# EAGLE design BSB-Board (EAGLE 8.3.2)
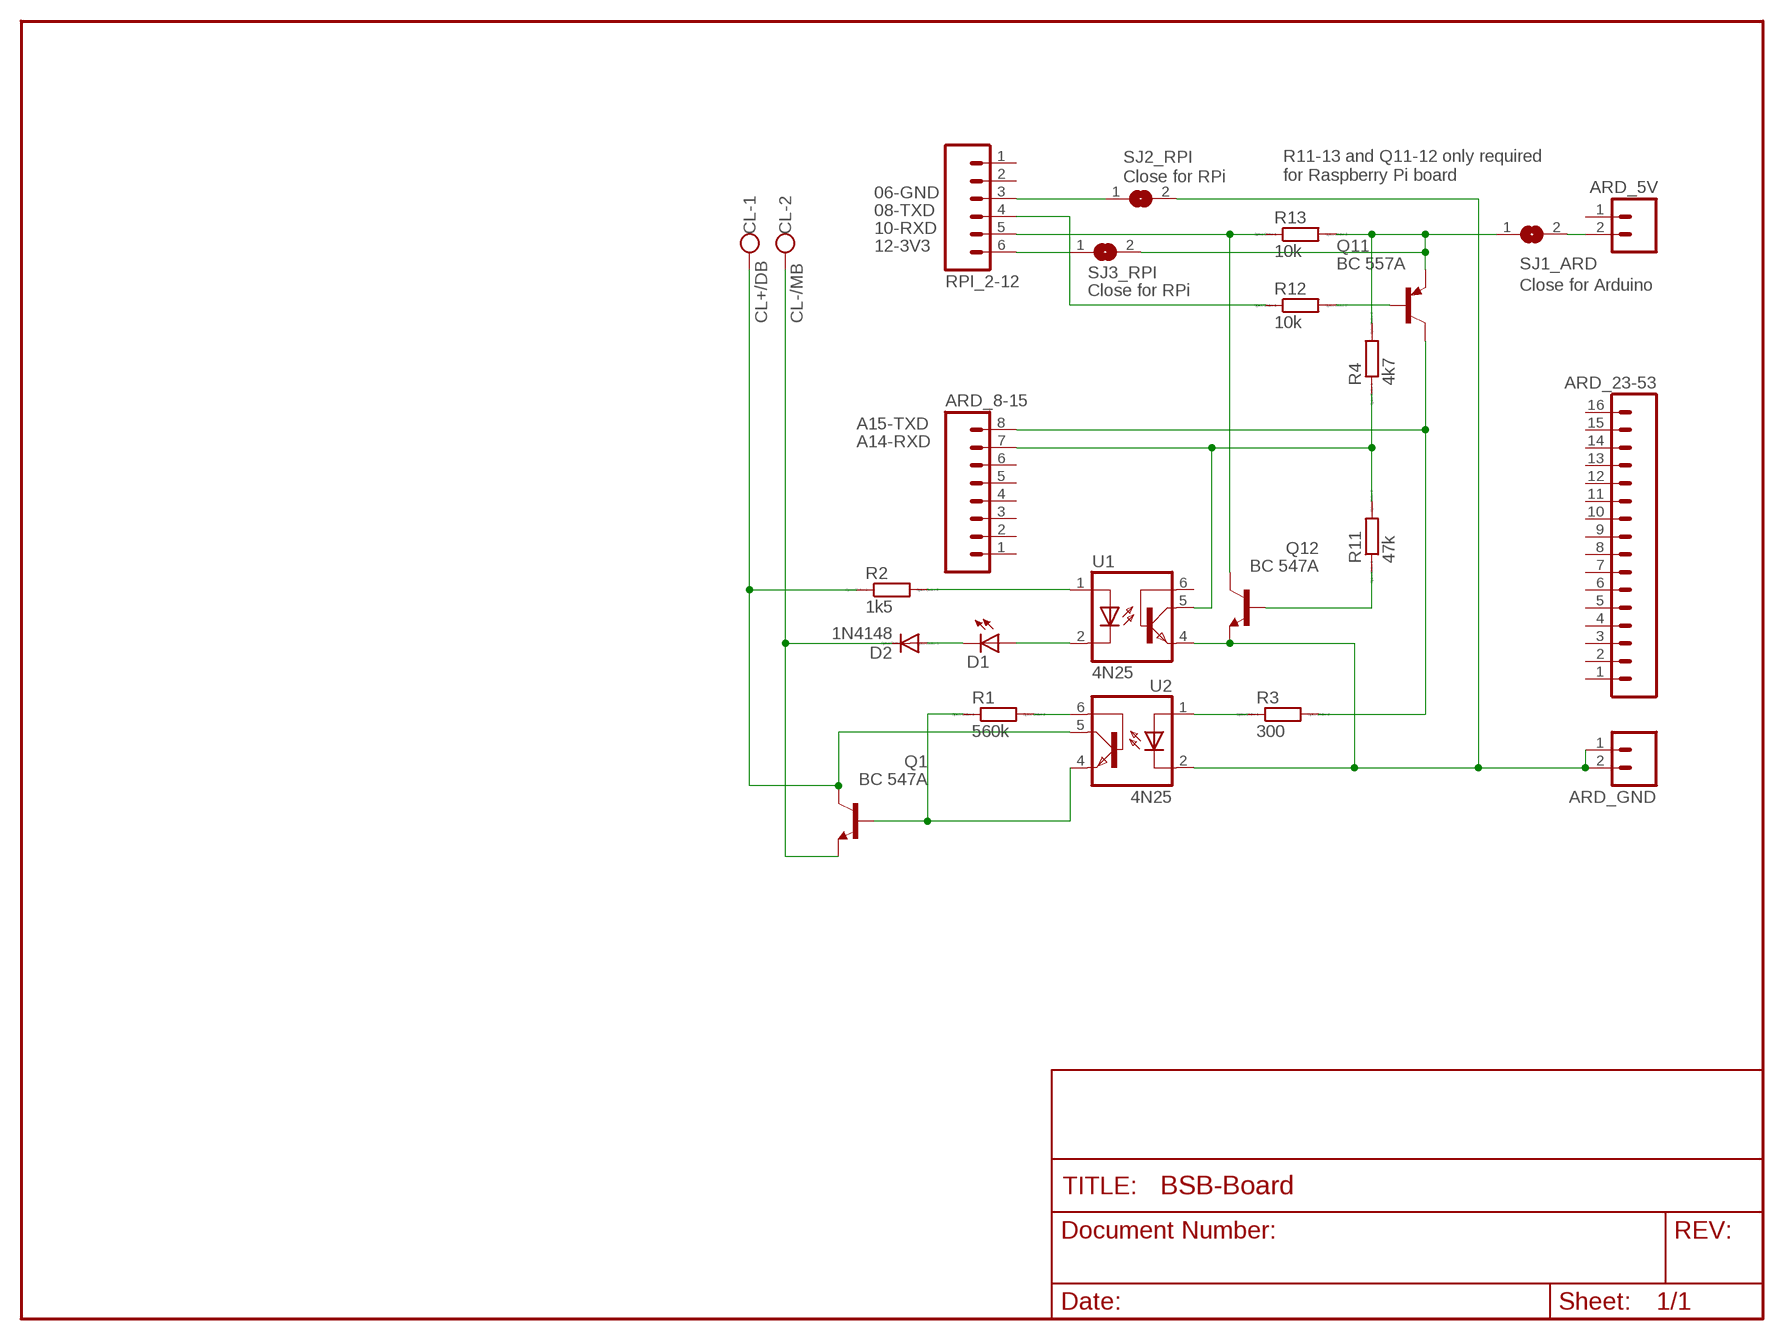
[diagram p0: schematic, sheet 1]

## Parts
ARD_5V  M02PTH  [1X02]
ARD_8-15  M08  [1X08_ROUND]
ARD_23-53  M16PTH  [1X16]
ARD_GND  M02PTH  [1X02]
CL  W237-102  [W237-102]
D1  LEDSQR2X5  [LED2X5]
D2  1N4148  1N4148DO35-7  [DO35-7]
Q1  BC 547A  BC547-NPN-TO92-CBE  [TO92-CBE]
Q11  BC 557A  -PNP-TO92-CBE  [TO92-CBE]
Q12  BC 547A  BC547-NPN-TO92-CBE  [TO92-CBE]
R1  560k  R-EU_0204_7  [0204/7]
R2  1k5  R-EU_0204_7  [0204/7]
R3  300  R-EU_0204_7  [0204/7]
R4  4k7  R-EU_0204_7  [0204/7]
R11  47k  R-EU_0204_7  [0204/7]
R12  10k  R-EU_0204_7  [0204/7]
R13  10k  R-EU_0204_7  [0204/7]
RPI_2-12  M06SILK_FEMALE_PTH  [1X06]
SJ1_ARD  Close for Arduino  SJ  [SJ]
SJ2_RPI  Close for RPi  SJ  [SJ]
SJ3_RPI  Close for RPi  SJ  [SJ]
U1  4N25  4N25M  [DIL06]
U2  4N25  4N25M  [DIL06]

## Nets
5V-ARD: ARD_5V.2 SJ1_ARD.2
A14-RXD-ARD: ARD_8-15.7 R4.1 R11.2 U1.5(COL)
A15-TXD-ARD: ARD_8-15.8 Q11.C R3.2
ARD_PI_TXD: R3.1 U2.1(A)
CL+: CL.1 Q1.C R2.1 U2.5(COL)
CL-: CL.2 D2.C Q1.E
GND-ARD: ARD_GND.1 ARD_GND.2 Q12.E SJ2_RPI.2 U1.4(EMI) U2.2(C)
GPIO14-TXD-PI: R12.1 RPI_2-12.4
GPIO15-RXD-PI: Q12.C R13.1 RPI_2-12.5
GPIO18-3V3-PI: RPI_2-12.6 SJ3_RPI.1
N$1: R2.2 U1.1(A)
N$2: D1.A U1.2(C)
N$3: R1.2 U2.6(BAS)
N$4: D1.K(C) D2.A
N$5: Q1.B R1.1 U2.4(EMI)
N$6: Q12.B R11.1
N$9: Q11.B R12.2
PIN6-GND-PI: RPI_2-12.3 SJ2_RPI.1
VCC: Q11.E R4.2 R13.2 SJ1_ARD.1 SJ3_RPI.2
Unconnected: ARD_5V.1 ARD_8-15.1 ARD_8-15.2 ARD_8-15.3 ARD_8-15.4 ARD_8-15.5 ARD_8-15.6 ARD_23-53.1 ARD_23-53.2 ARD_23-53.3 ARD_23-53.4 ARD_23-53.5 ARD_23-53.6 ARD_23-53.7 ARD_23-53.8 ARD_23-53.9 ARD_23-53.10 ARD_23-53.11 ARD_23-53.12 ARD_23-53.13 ARD_23-53.14 ARD_23-53.15 ARD_23-53.16 RPI_2-12.1 RPI_2-12.2 U1.6(BAS)

## Notes on the sheet
- R11-13 and Q11-12 only required
  for Raspberry Pi board
- 06-GND
- 08-TXD
- 10-RXD
- 12-3V3
- CL+/DB | CL-/MB
- A15-TXD
- A14-RXD

## Library data of the parts
ARD_5V ARD_GND = SparkFun-Connectors:M02: Standard 2-pin 0.1" header. Use with - straight break away headers ( PRT-00116) - right angle break away headers (PRT-00553) - swiss pins (PRT-00743) - machine pins (PRT-00117) - female headers (PRT-00115) Molex polarized connector foot print use with: PRT-08233 with associated crimp pins and housings. 2.54_SCREWTERM for use with PRT-10571. 3.5mm Screw Terminal footprints for PRT-08084 5mm Screw Terminal footprints for use with PRT-08432
ARD_8-15 = SparkFun-Connectors:M08: Header 8 Standard 8-pin 0.1" header. Use with straight break away headers (SKU : PRT-00116), right angle break away headers (PRT-00553), swiss pins (PRT-00743), machine pins (PRT-00117), and female headers (PRT-00115).
ARD_23-53 = SparkFun-Connectors:M16: 1x16 .1" header
CL = con-wago-500:W237-102: WAGO SCREW CLAMP; MPN: 237-102; OC_FARNELL: unknown; OC_NEWARK: 70K9898
D1 = led:LED: LED OSRAM: - CHIPLED LG R971, LG N971, LY N971, LG Q971, LY Q971, LO R971, LY R971 LH N974, LH R974 LS Q976, LO Q976, LY Q976 LO Q996 - Hyper CHIPLED LW Q18S LB Q993, LB Q99A, LB R99A - SideLED LS A670, LO A670, LY A670, LG A670, LP A670 LB A673, LV A673, LT A673, LW A673 LH A674 LY A675 LS A676, LA A676, LO A676, LY A676, LW A676 LS A679, LY A679, LG A679 - Hyper Micro SIDELED® LS Y876, LA Y876, LO Y876, LY Y876 LT Y87S - SmartLED LW L88C, LW L88S LB L89C, LB L89S, LG L890 LS L89K, LO L89K, LY L89K LS L896, LA L896, LO L896, LY L896 - TOPLED LS T670, LO T670, LY T670, LG T670, LP T670 LSG T670, LSP T670, LSY T670, LOP T670, LYG T670 LG T671, LOG T671, LSG T671 LB T673, LV T673, LT T673, LW T673 LH T674 LS T676, LA T676, LO T676, LY T676, LB T676, LH T676, LSB T676, LW T676 LB T67C, LV T67C, LT T67C, LS T67K, LO T67K, LY T67K, LW E67C LS E67B, LA E67B, LO E67B, LY E67B, LB E67C, LV E67C, LT E67C LW T67C LS T679, LY T679, LG T679 LS T770, LO T770, LY T770, LG T770, LP T770 LB T773, LV T773, LT T773, LW T773 LH T774 LS E675, LA E675, LY E675, LS T675 LS T776, LA T776, LO T776, LY T776, LB T776 LHGB T686 LT T68C, LB T68C - Hyper Mini TOPLED® LB M676 - Mini TOPLED Santana® LG M470 LS M47K, LO M47K, LY M47K Source: http://www.osram.convergy.de LUXEON: - LUMILED® LXK2-PW12-R00, LXK2-PW12-S00, LXK2-PW14-U00, LXK2-PW14-V00 LXK2-PM12-R00, LXK2-PM12-S00, LXK2-PM14-U00 LXK2-PE12-Q00, LXK2-PE12-R00, LXK2-PE12-S00, LXK2-PE14-T00, LXK2-PE14-U00 LXK2-PB12-K00, LXK2-PB12-L00, LXK2-PB12-M00, LXK2-PB14-N00, LXK2-PB14-P00, LXK2-PB14-Q00 LXK2-PR12-L00, LXK2-PR12-M00, LXK2-PR14-Q00, LXK2-PR14-R00 LXK2-PD12-Q00, LXK2-PD12-R00, LXK2-PD12-S00 LXK2-PH12-R00, LXK2-PH12-S00 LXK2-PL12-P00, LXK2-PL12-Q00, LXK2-PL12-R00 Source: www.luxeon.com KINGBRIGHT: KA-3528ASYC Source: www.kingbright.com
D2 = diode:1N4148: DIODE high speed (Philips)
Q1 Q12 = transistor:*-NPN-: NPN Transistror BF959 corrected 2008.03.06
Q11 = transistor-neu-to92:*-PNP-: PNP Transistror
R1-R4 R11-R13 = resistor:R-EU_: RESISTOR, European symbol; SPICEPREFIX: R
RPI_2-12 = SparkFun-Connectors:M06: Header 6 Standard 6-pin 0.1" header. Use with straight break away headers (SKU : PRT-00116), right angle break away headers (PRT-00553), swiss pins (PRT-00743), machine pins (PRT-00117), and female headers (PRT-00115). Molex polarized connector foot print use with SKU : PRT-08094 with associated crimp pins and housings. NOTES ON THE VARIANTS LOCK and LOCK_LONGPADS... This footprint was designed to help hold the alignment of a through-hole component (i.e. 6-pin header) while soldering it into place. You may notice that each hole has been shifted either up or down by 0.005 of an inch from it's more standard position (which is a perfectly straight line). This slight alteration caused the pins (the squares in the middle) to touch the edges of the holes. Because they are alternating, it causes a "brace" to hold the component in place. 0.005 has proven to be the perfect amount of "off-center" position when using our standard breakaway headers. Although looks a little odd when you look at the bare footprint, once you have a header in there, the alteration is very hard to notice. Also,if you push a header all the way into place, it is covered up entirely on the bottom side. This idea of altering the position of holes to aid alignment will be further integrated into the Sparkfun Library for other footprints. It can help hold any component with 3 or more connection pins.; PROD_ID: CONN-08437
SJ1_ARD SJ2_RPI SJ3_RPI = jumper:SJ: SMD solder JUMPER
U1 U2 = optocoupler:4N*?M: General Purpose 6-Pin Phototransistor Optocouplers Source: http://www.fairchildsemi.com/ds/4N/4N35-M.pdf; MPN: 4N25-M; OC_FARNELL: 1021349; OC_NEWARK: 98K9084

## Board
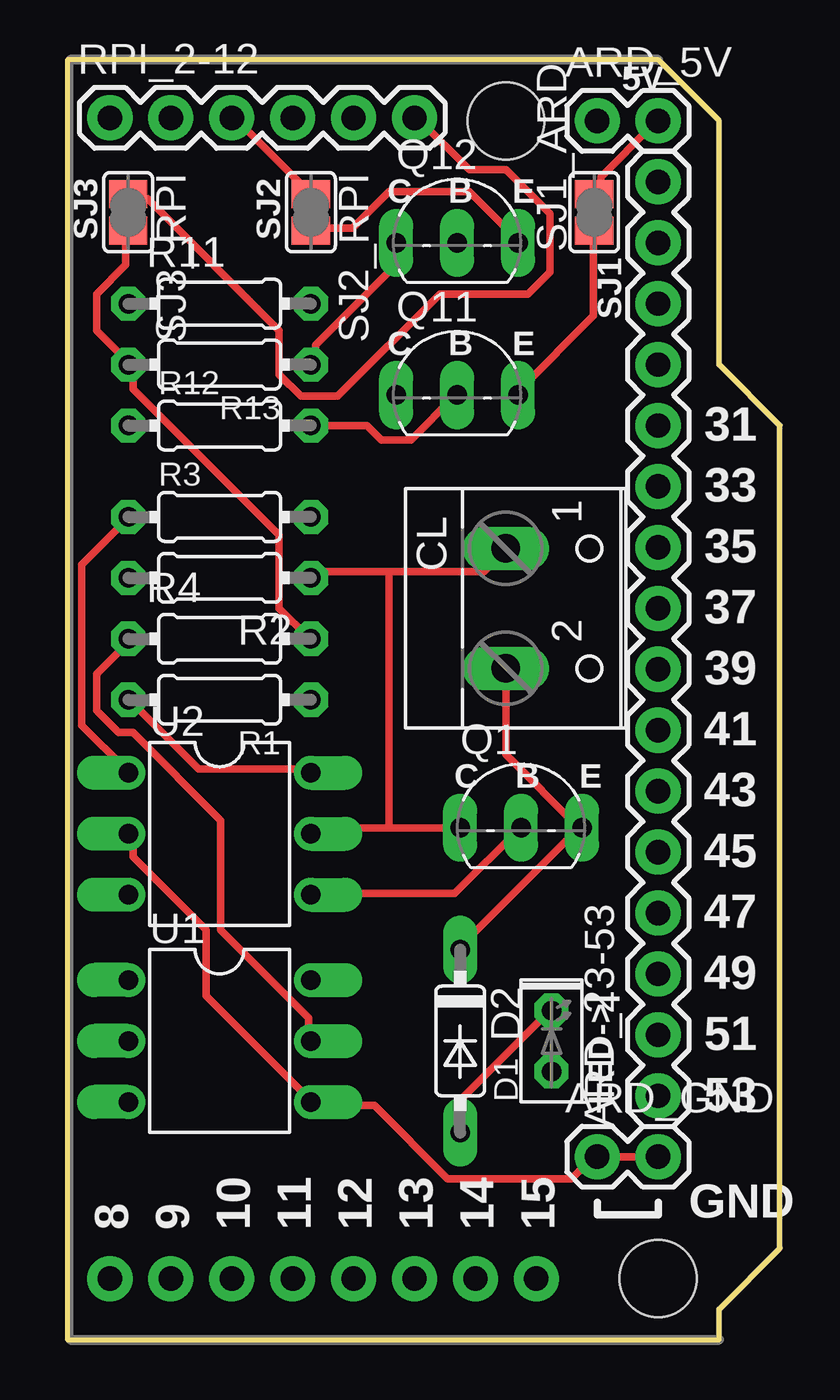
[diagram p1: board, top side]
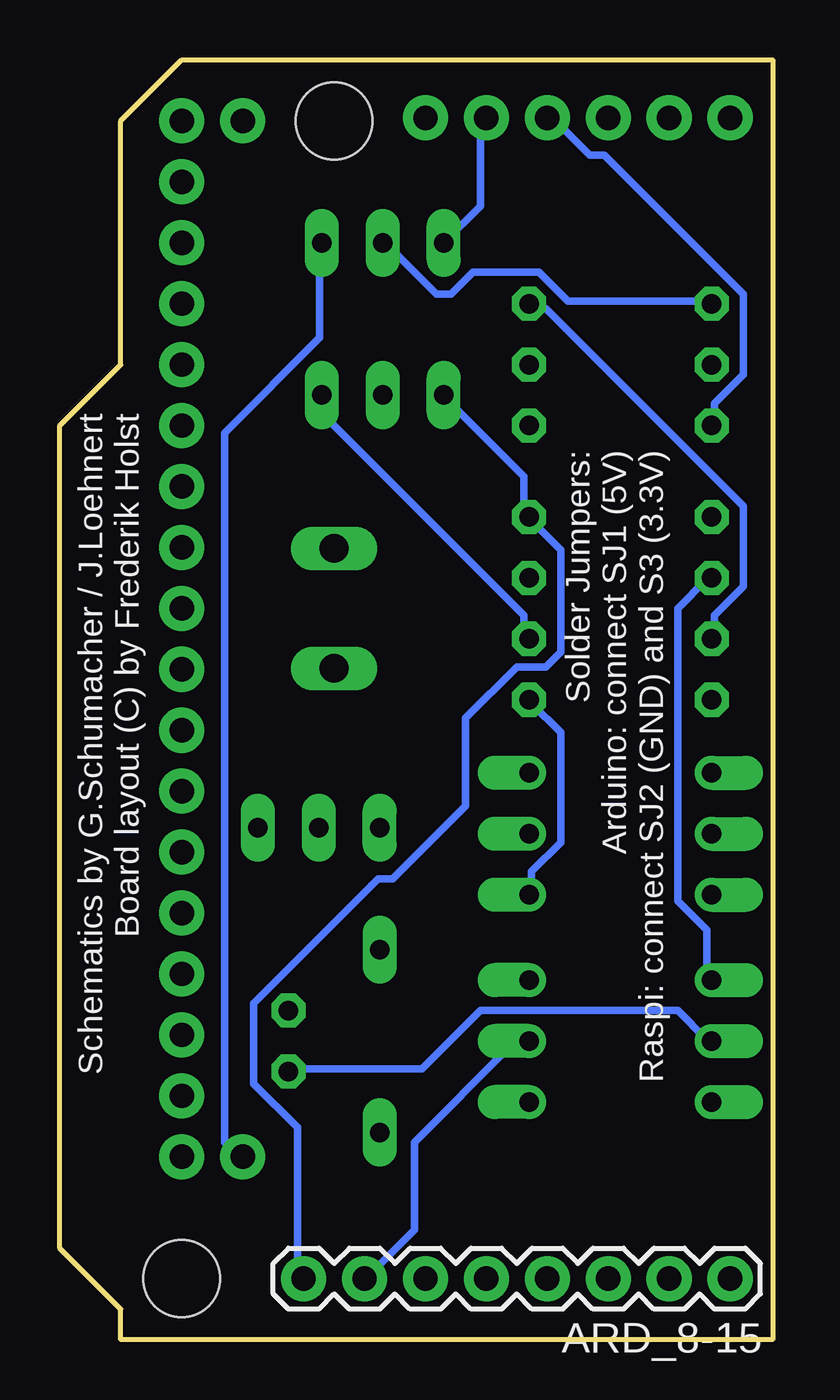
[diagram p2: board, bottom side, seen from below]

Size 29.72 x 53.34 mm. Coordinates in mm from the lower left corner, seen from the top.
Outline: 0,0 27.18,0 27.18,1.27 29.72,3.81 29.72,38.1 27.18,40.64 27.18,50.8 24.64,53.34 0,53.34 0,0
Copper layers (1*16): Top 0.035mm / dielectric 1.5mm / Bottom 0.035mm
Design rules "SparkFun *": minimum track width 12mil, minimum drill 20mil, track to track 12mil, track to pad 12mil, pad to pad 12mil, via to via 8mil, smd to smd 8mil, copper to edge 10mil, drill to drill 8mil, minimum pad ring 12mil, minimum via ring 10mil, stop-mask expansion 4mil, vias tented up to drill 25mil, thermal gap 10mil
Holes 3.2 mm at 18.29,50.8 24.64,2.54

### Footprints (pad centres in the part's own frame; a part is rotated, then mirrored left to right if it is on the bottom)
1X02 = drill 1.016 pad 1.88: 1 0,0; 2 2.54,0
1X08_ROUND = drill 1.016 pad 1.88: 1 0,0; 2 2.54,0; 3 5.08,0; 4 7.62,0; 5 10.16,0; 6 12.7,0; 7 15.24,0; 8 17.78,0
1X16 = drill 1.016 pad 1.88: 1 0,0; 2 2.54,0; 3 5.08,0; 4 7.62,0; 5 10.16,0; 6 12.7,0; 7 15.24,0; 8 17.78,0; 9 20.32,0; 10 22.86,0; 11 25.4,0; 12 27.94,0; 13 30.48,0; 14 33.02,0; 15 35.56,0; 16 38.1,0
W237-102 = drill 1.194 long: 1 -2.5,-1.27; 2 2.5,-1.27
LED2X5 = drill 0.813 octagon: A -1.27,0; K 1.27,0
DO35-7 = drill 0.813 long: A 3.81,0; C -3.81,0
TO92-CBE = drill 0.813 long: B 0,0; C -2.54,0; E 2.54,0
0204/7 = drill 0.813 octagon: 1 -3.81,0; 2 3.81,0
1X06 = drill 1.016 pad 1.88: 1 0,0; 2 2.54,0; 3 5.08,0; 4 7.62,0; 5 10.16,0; 6 12.7,0
SJ = smd 1.168 x 1.6: 1 -0.762,0; 2 0.762,0
DIL06 = drill 0.813 offset: 1 -2.54,-3.81; 2 0,-3.81; 3 2.54,-3.81; 4 2.54,3.81; 5 0,3.81; 6 -2.54,3.81

### Placement (x,y rotation side)
ARD_5V  22.1,50.8 0 top
ARD_8-15  1.78,2.54 180 bottom
ARD_23-53  24.64,10.16 90 top
ARD_GND  22.1,7.62 0 top
CL  19.56,30.48 270 top
D1  20.19,12.45 90 top
D2  16.38,12.45 270 top
Q1  18.92,21.34 0 top
Q11  16.26,39.37 0 top
Q12  16.26,45.72 0 top
R1  6.35,26.67 180 top
R2  6.35,31.75 180 top
R3  6.35,34.29 0 top
R4  6.35,29.21 0 top
R11  6.35,43.18 0 top
R12  6.35,38.1 0 top
R13  6.35,40.64 180 top
RPI_2-12  1.78,50.93 0 top
SJ1_ARD  21.97,46.99 90 top
SJ2_RPI  10.16,46.99 270 top
SJ3_RPI  2.54,46.99 270 top
U1  6.35,12.45 270 top
U2  6.35,21.08 270 top

### Tracks (layer width: path | path; a pad name or v marks a point on that pad's centre or on a via)
5V-ARD
  Top 0.305: SJ1_ARD.2 22.25,47.85 22.25,48.46 24.38,50.6 ARD_5V.2
A14-RXD-ARD
  Top 0.305: U1.5 10.06,12.5 10.06,13.41 6.4,17.07 6.4,21.64 2.74,25.3 2.13,25.3 1.22,26.21 1.22,27.74 2.44,28.96 R4.1
  Bottom 0.305: R4.1 2.44,29.26 2.44,30.18 1.22,31.39 1.22,34.75 9.45,42.98 10.06,42.98 R11.2 | U1.5 10.36,12.19 10.97,12.19 14.94,8.23 14.94,4.57 16.76,2.74 ARD_8-15.7
A15-TXD-ARD
  Bottom 0.305: Q11.C 13.72,39.32 10.36,35.97 10.36,34.44 R3.2 10.06,34.14 8.84,32.92 8.84,28.65 9.45,28.04 10.67,28.04 12.8,25.91 12.8,22.25 15.85,19.2 16.46,19.2 21.64,14.02 21.64,10.67 19.81,8.84 19.81,2.74 ARD_8-15.8
ARD_PI_TXD
  Top 0.305: U2.1 2.44,23.77 0.61,25.6 0.61,32.31 2.44,34.14 R3.1
CL+
  Top 0.305: Q1.C 13.41,21.34 | 13.41,21.34 10.36,21.34 U2.5 | 13.41,32 17.37,32 18.29,32.92 CL.1 | 13.41,32 10.36,32 R2.1 | 13.41,32 13.41,21.34
CL-
  Top 0.305: 21.34,21.34 16.46,16.46 D2.C | CL.2 18.29,24.38 21.34,21.34 | 21.34,21.34 Q1.E
GND-ARD
  Top 0.305: SJ2_RPI.2 10.36,46.33 11.89,46.33 13.41,47.85 16.76,47.85 18.9,45.72 Q12.E | ARD_GND.2 ARD_GND.1 21.95,7.62 21.03,6.71 15.85,6.71 12.8,9.75 10.36,9.75 U1.4 10.06,10.06 5.79,14.33 5.79,17.07 2.74,20.12 2.74,21.03 U2.2
  Bottom 0.305: Q12.E 18.9,45.72 18.9,41.76 22.86,37.8 22.86,8.23 22.25,7.62 ARD_GND.1
GPIO14-TXD-PI
  Bottom 0.305: R12.1 2.44,38.1 2.44,39.01 1.22,40.23 1.22,43.59 7.01,49.38 7.62,49.38 9.14,50.9 RPI_2-12.4
GPIO15-RXD-PI
  Top 0.305: Q12.C 13.72,44.81 10.36,41.45 10.36,40.84 R13.1
  Bottom 0.305: Q12.C 12.19,47.24 12.19,50.9 RPI_2-12.5
GPIO18-3V3-PI
  Top 0.305: SJ3_RPI.1 2.74,47.55 3.35,47.55 8.84,42.06 8.84,40.23 9.75,39.32 11.28,39.32 15.54,43.59 19.2,43.59 20.12,44.5 20.12,46.94 18.29,48.77 16.76,48.77 14.63,50.9 RPI_2-12.6
N$1
  Bottom 0.305: U1.1 2.74,15.24 2.74,17.07 3.96,18.29 3.96,30.48 2.74,31.7 R2.2
N$2
  Bottom 0.305: D1.A 20.12,11.28 14.63,11.28 12.19,13.72 3.96,13.72 2.74,12.5 U1.2
N$3
  Top 0.305: U2.6 10.06,23.77 5.49,23.77 2.74,26.52 R1.2
N$4
  Top 0.305: D2.A 16.46,8.84 16.46,10.06 20.12,13.72 D1.K
N$5
  Top 0.305: Q1.B 18.9,21.34 16.15,18.59 10.36,18.59 U2.4
  Bottom 0.305: U2.4 10.06,18.59 10.06,19.51 8.84,20.73 8.84,25.3 10.06,26.52 R1.1
N$6
  Bottom 0.305: R11.1 2.74,43.28 8.53,43.28 9.75,44.5 12.5,44.5 13.41,43.59 14.02,43.59 16.15,45.72 Q12.B
N$9
  Top 0.305: R12.2 12.5,38.1 13.11,37.49 14.33,37.49 16.15,39.32 Q11.B
PIN6-GND-PI
  Top 0.305: SJ2_RPI.1 7.01,50.9 RPI_2-12.3
VCC
  Top 0.305: SJ3_RPI.2 2.44,46.02 2.44,44.81 1.22,43.59 1.22,42.06 2.44,40.84 R13.2 2.74,40.54 2.74,39.62 8.84,33.53 8.84,30.48 10.06,29.26 R4.2 | SJ1_ARD.1 21.95,46.02 21.95,42.67 18.9,39.62 Q11.E
  Bottom 0.305: R4.2 10.36,29.26 10.36,30.18 18.59,38.41 18.59,39.32 Q11.E

### Text on the board
tPlace: 5V | C | B | E | SJ3 | SJ2 | SJ1 | C | B | E | 31 | 33 | 35 | 37 | 39 | 41 | C | B | E | 43 | 45 | 47 | 49 | 51 | LED->| | 53 | 8 | 9 | 10 | 11 | 12 | 13 | 14 | 15 | GND
bPlace: Schematics by G.Schumacher / J.Loehnert / Board layout (C) by Frederik Holst | Solder Jumpers: / Arduino: connect SJ1 (5V) / Raspi: connect SJ2 (GND) and S3 (3.3V)
tValues: RasPi 06 08 10 12 | DB / CL+ | MB / CL- | TX | RX | Arduino Connector RX TX